# Altium schematic sheet proy_10A_SCH_1_v1i1.SchDoc
size A
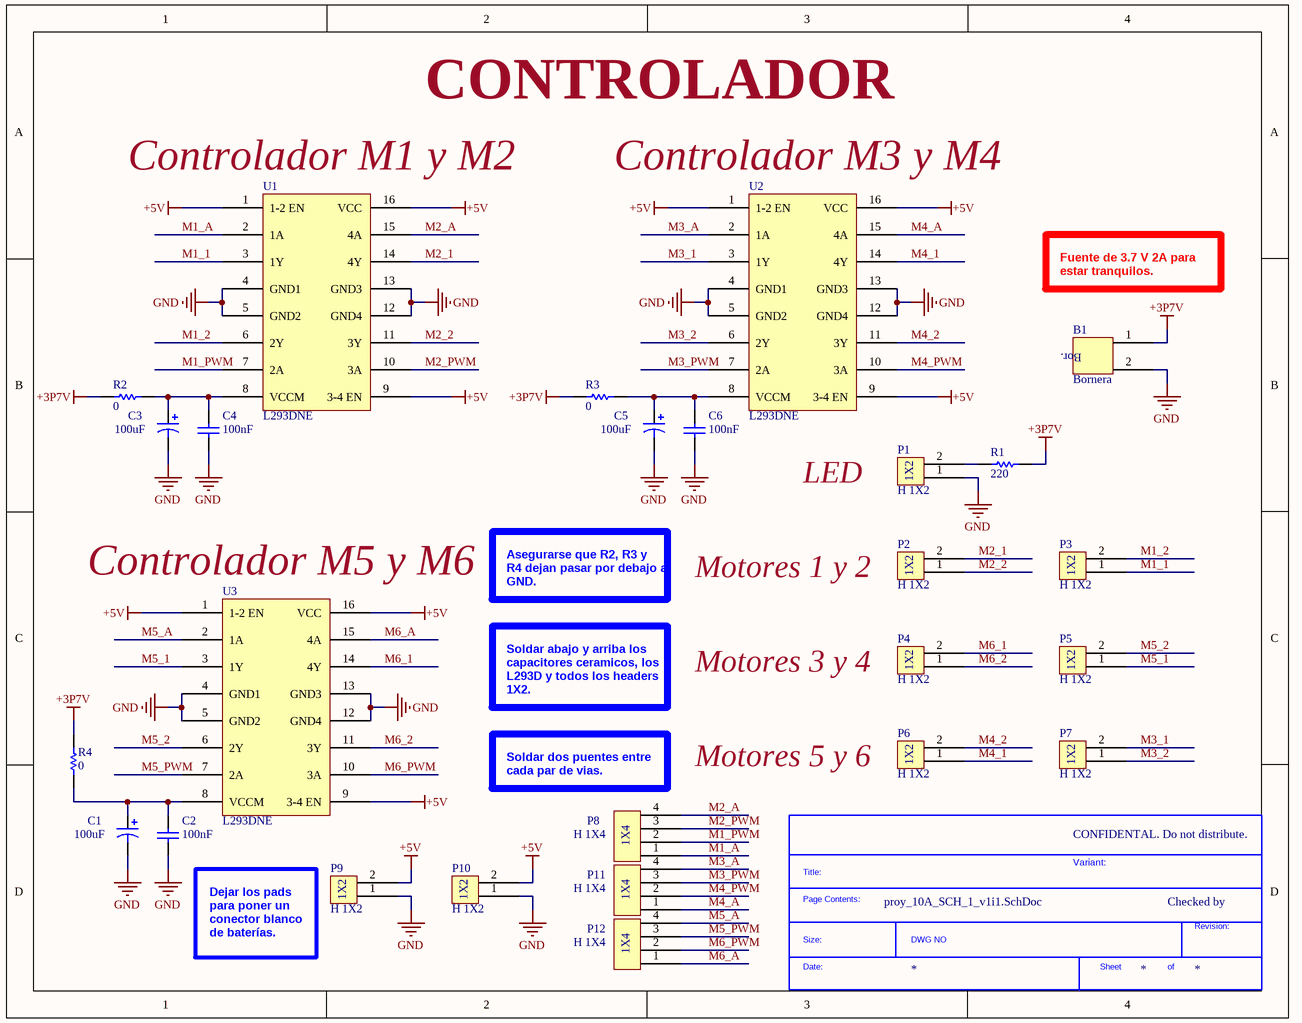
[diagram p0: proy_10A_SCH_1_v1i1.SchDoc]

## Parts
*  SDTitleBlock  (value not drawn)  (graphical)
B1  Bornera  [Bornera]
C1  100uF  [C 6.3x11]
C2  100nF  [C Lenteja]
C3  100uF  [C 6.3x11]
C4  100nF  [C Lenteja]
C5  100uF  [C 6.3x11]
C6  100nF  [C Lenteja]
P1  H 1X2  [H 1x2]
P2  H 1X2  [H 1x2]
P3  H 1X2  [H 1x2]
P4  H 1X2  [H 1x2]
P5  H 1X2  [H 1x2]
P6  H 1X2  [H 1x2]
P7  H 1X2  [H 1x2]
P8  H 1X4  [H 1X4 - Hembra]
P9  H 1X2  [H 1x2]
P10  H 1X2  [H 1x2]
P11  H 1X4  [H 1X4 - Hembra]
P12  H 1X4  [H 1X4 - Hembra]
R1  220  [R 1206]
R2  0  [R 1206]
R3  0  [R 1206]
R4  0  [R 1206]
U1  L293DNE  [DIP-16]
U2  L293DNE  [DIP-16]
U3  L293DNE  [DIP-16]

## Nets
+3P7V: B1.1 R1.2 R2.1 R3.1 R4.1
+5V: P9.2 P10.2 U1.1(1-2_EN) U1.9(3-4_EN) U1.16(VCC) U2.1(1-2_EN) U2.9(3-4_EN) U2.16(VCC) U3.1(1-2_EN) U3.9(3-4_EN) U3.16(VCC)
GND: B1.2 C1.2 C2.1 C3.2 C4.1 C5.2 C6.1 P1.1 P9.1 P10.1 U1.4(GND1) U1.5(GND2) U1.12(GND4) U1.13(GND3) U2.4(GND1) U2.5(GND2) U2.12(GND4) U2.13(GND3) U3.4(GND1) U3.5(GND2) U3.12(GND4) U3.13(GND3)
M1_1: P3.1 U1.3(1Y)
M1_2: P3.2 U1.6(2Y)
M1_A: P8.1 U1.2(1A)
M1_PWM: P8.2 U1.7(2A)
M2_1: P2.2 U1.14(4Y)
M2_2: P2.1 U1.11(3Y)
M2_A: P8.4 U1.15(4A)
M2_PWM: P8.3 U1.10(3A)
M3_1: P7.2 U2.3(1Y)
M3_2: P7.1 U2.6(2Y)
M3_A: P11.4 U2.2(1A)
M3_PWM: P11.3 U2.7(2A)
M4_1: P6.1 U2.14(4Y)
M4_2: P6.2 U2.11(3Y)
M4_A: P11.1 U2.15(4A)
M4_PWM: P11.2 U2.10(3A)
M5_1: P5.1 U3.3(1Y)
M5_2: P5.2 U3.6(2Y)
M5_A: P12.4 U3.2(1A)
M5_PWM: P12.3 U3.7(2A)
M6_1: P4.2 U3.14(4Y)
M6_2: P4.1 U3.11(3Y)
M6_A: P12.1 U3.15(4A)
M6_PWM: P12.2 U3.10(3A)
NetC1_1: C1.1 C2.2 R4.2 U3.8(VCCM)
NetC3_1: C3.1 C4.2 R2.2 U1.8(VCCM)
NetC5_1: C5.1 C6.2 R3.2 U2.8(VCCM)
NetP1_2: P1.2 R1.1

## Notes on the sheet
- CONTROLADOR
- (near U1) Controlador M1 y M2
- (near U2) Controlador M3 y M4
- Fuente de 3.7 V 2A para estar tranquilos.
- LED
- (near U3) Controlador M5 y M6
- Asegurarse que R2, R3 y
  R4 dejan pasar por debajo a GND.
- (near P2) Motores 1 y 2
- Soldar abajo y arriba los capacitores ceramicos, los L293D y todos los headers 1X2.
- (near P4) Motores 3 y 4
- (near P6) Motores 5 y 6
- (near P8) Soldar dos puentes entre cada par de vias.
- CONFIDENTAL. Do not distribute.
- Variant:
- Checked by
- Dejar los pads
  para poner un conector blanco de baterías.
- (in symbol Bornera) Bor.
- (in symbol H 1X2) 1X2
- (in symbol H 1X4) 1X4
- (in symbol SDTitleBlock) Title:; Page Contents:; Revision:; Size:; DWG NO; Date:; Sheet; of

## Library data of the parts
B1 = Bornera: Bornera de 2 terminales.; .Creator: SR; .PCBCheck: Used; .SCHCheck: Used
C1 C3 C5 = C POL: Capacitor polarizado.; .Creator: SR
C2 C4 C6 = C: Capacitor; .PCBCheck: Used; .Creator: SR; .SCHCheck: Used; Category: Capacitores
P1-P7 P9 P10 = H 1X2: PIN HEADER 1X2; .Creator: SR; .PCBCheck: Used; .SCHCheck: Used
P8 P11 P12 = H 1X4: PIN HEADER 1X4; .Creator: SR; .PCBCheck: Used; .SCHCheck: Used
R1-R4 = R: Resistencia; .Creator: SR; .PCBCheck: Used; .SCHCheck: Used; Category: Resistencias
U1-U3 = L293DNE: IC MOTOR DRIVER PAR 16-DIP; Manufacturer: Texas Instruments; Motor Type - Stepper: Bipolar; Motor Type - AC, DC: Brushed DC; Function: Driver - Fully Integrated, Control and Power Stage; Output Configuration: Half Bridge, (4) Quad; Interface: Parallel; Current - Output: 600mA; Voltage - Supply: 4.5 V ~ 36 V; .Creator: SR; Supplier 1: Digi-Key; Manufacturer Part Number: L293DNE; RoHS: RoHS Compliant; Category: Integrated Circuits (ICs); Stock 1: 1900; Pricing 1: 1=3.75, 25=3.0152, 100=2.747, 250=2.479, 500=2.2244, 750=2.01, 1000=1.876 (USD); Packaging: Tube; Applications: General Purpose; Voltage - Load: 4.5 V ~ 36 V; Operating Temperature: 0°C ~ 70°C; Mounting Type: Through Hole; Package / Case: 16-DIP (0.300", 7.62mm); Supplier Device Package: 16-PDIP; ComponentLink1URL: http://www.ti.com/lit/ds/symlink/l293d.pdf; ComponentLink1Description: http://www.ti.com/lit/ds/symlink/l293d.pdf; Supplier Part Number 1: 296-9518-5-ND; .PCBCheck: SR; .SCHCheck: SR